# EAGLE design plug-v21-Make-board-myself-to-test-circuit (EAGLE 7.6.0)
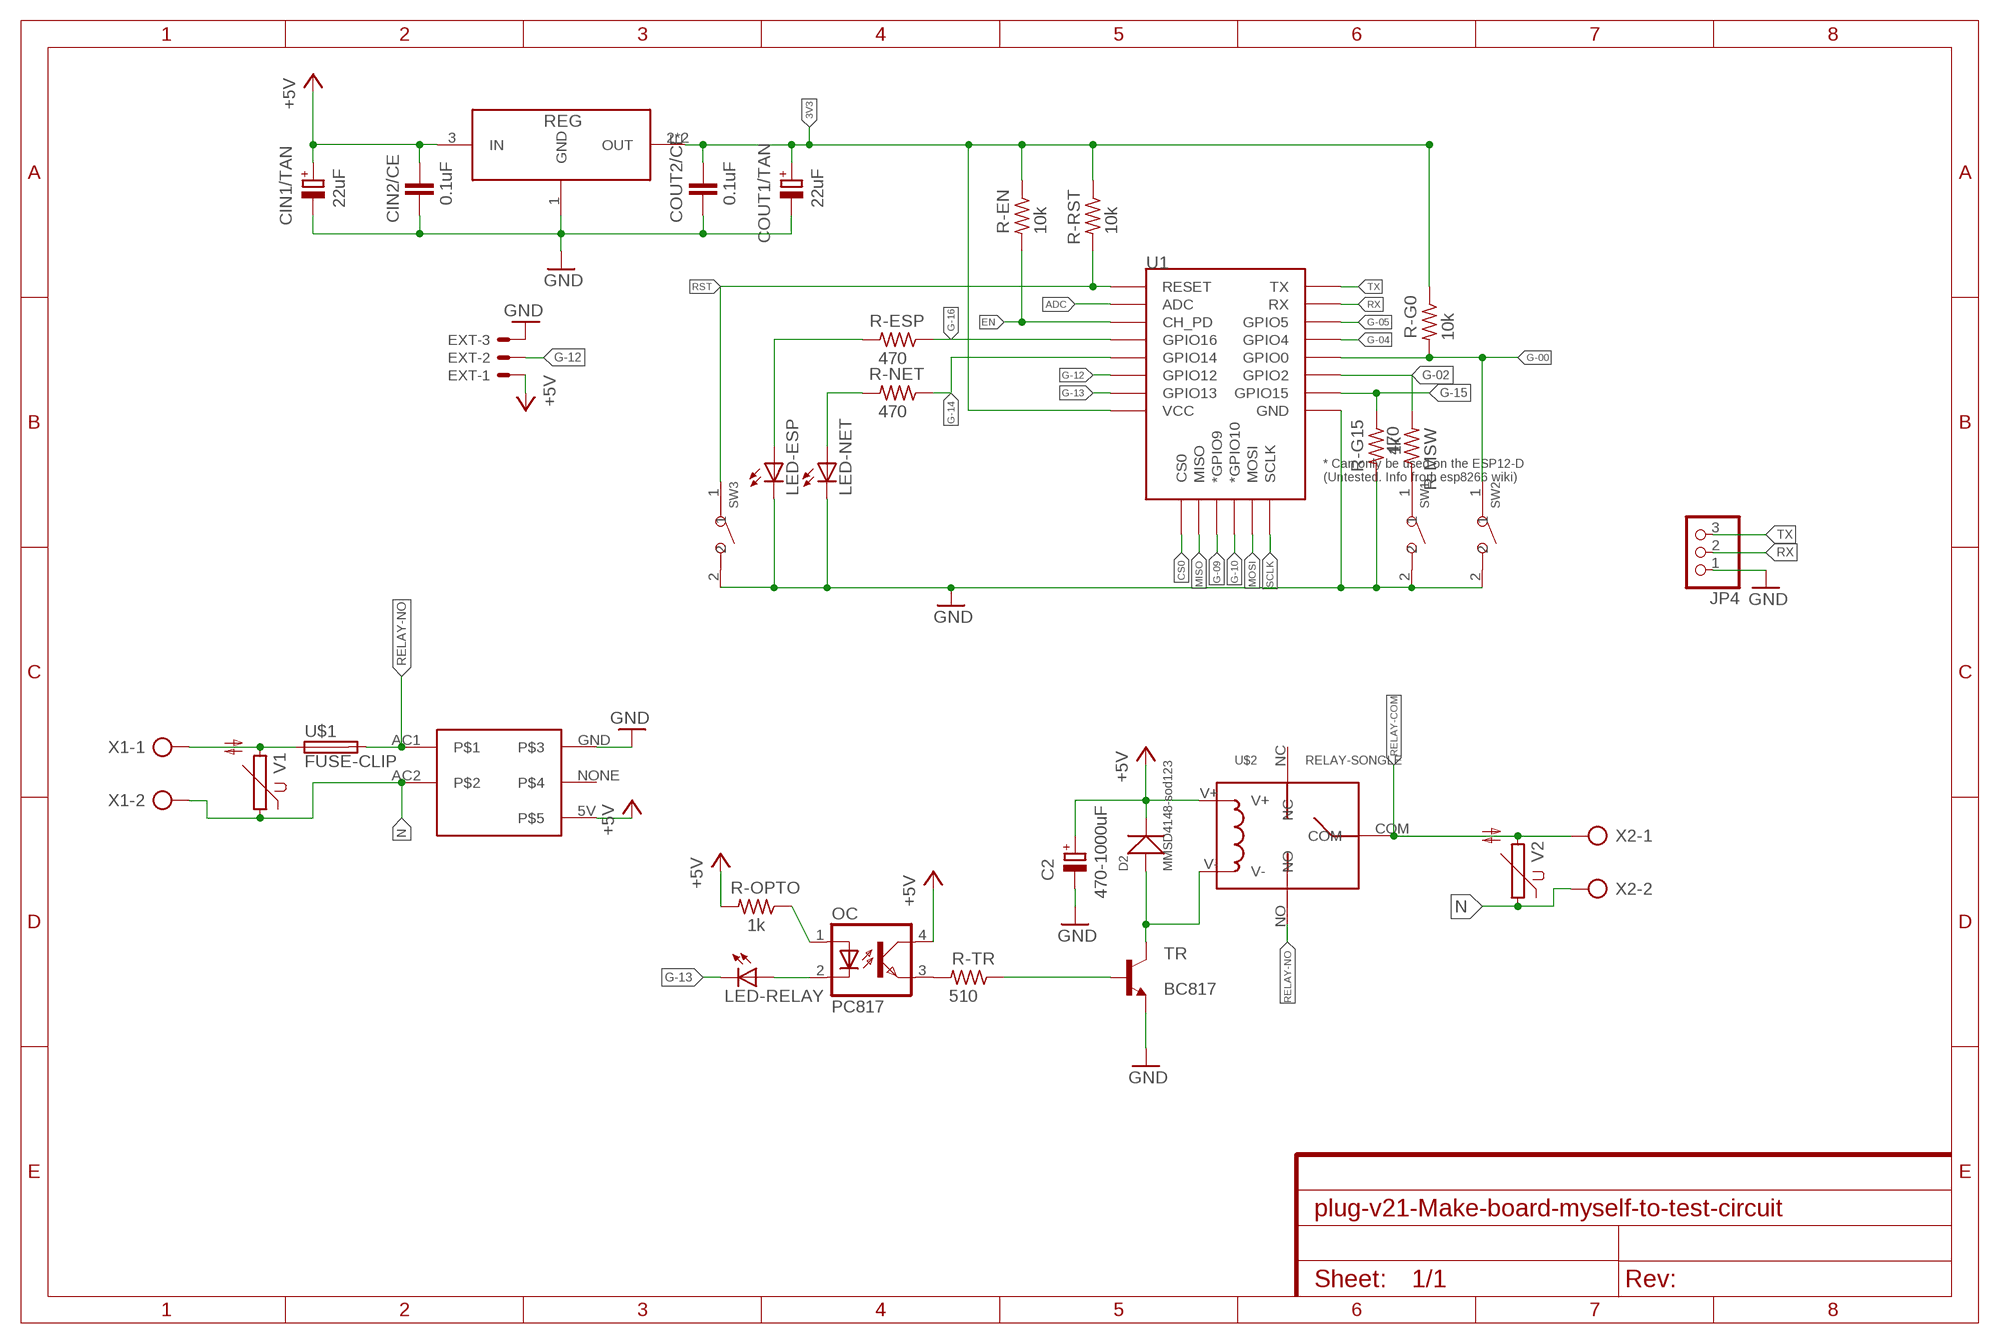
[diagram p0: schematic, sheet 1]

## Parts
C2  470-1000uF  CPOL-EUE3.5-8  [E3,5-8]
CIN1/TAN  22uF  CPOL-EUB/3528-21R  [B/3528-21R]
CIN2/CE  0.1uF  C-EUC0805K  [C0805K]
COUT1/TAN  22uF  CPOL-EUB/3528-21R  [B/3528-21R]
COUT2/CE  0.1uF  C-EUC0805K  [C0805K]
D2  MMSD4148-sod123  SMD-DIODE-100V-200MA(SOD-123)  [SOD-123]
EXT  53048-03  [53048-03]
JP4  PINHD-1X3  [1X03]
LED-ESP  LEDCHIPLED_0805  [CHIPLED_0805]
LED-NET  LEDCHIPLED_0805  [CHIPLED_0805]
LED-RELAY  LEDCHIPLED_0805  [CHIPLED_0805]
OC  PC817  [DIL04]
R-EN  10k  R-US_M0805  [M0805]
R-ESP  470  R-US_M0805  [M0805]
R-G0  10k  R-US_M0805  [M0805]
R-G15  1k  R-US_M0805  [M0805]
R-MSW  470  R-US_M0805  [M0805]
R-NET  470  R-US_M0805  [M0805]
R-OPTO  1k  R-US_M0805  [M0805]
R-RST  10k  R-US_M0805  [M0805]
R-TR  510  R-US_M0805  [M0805]
REG  AMS1117-3.3  [SOT-223]
SW1  DIP-BUTTON(2P-6.0X3.0X4.3MM)-TS-1101F  [SW2-5.0-6.0X3.0X4.3MM]
SW2  DIP-BUTTON(2P-6.0X3.0X4.3MM)-TS-1101F  [SW2-5.0-6.0X3.0X4.3MM]
SW3  DIP-BUTTON(2P-6.0X3.0X4.3MM)-TS-1101F  [SW2-5.0-6.0X3.0X4.3MM]
TR  BC817  BC817-16SMD  [SOT23-BEC]
U1  ESP12ESMD  [ESP12E-SMD]
U$1  FUSE-CLIP  [FUSE-CLIP]
U$2  RELAY-SONGLE  [RELAY-SONGLE]
U$4  POWERSUPPLY-5V-700MA  [POWERSUPPLY-5V-700MA]
V1  S14K11  [S14K11]
V2  S14K11  [S14K11]
X1  AK300/2  [AK300/2]
X2  AK300/2  [AK300/2]

## Nets
3V3: COUT1/TAN.+ COUT2/CE.1 R-EN.1 R-G0.1 R-RST.1 REG.2(OUT) REG.4(OUT) U1.VCC
+5V: C2.+ CIN1/TAN.+ CIN2/CE.1 D2.- EXT.1 OC.4(COL) R-OPTO.2 REG.3(IN) U$2.V+ U$4.5V
ADC: U1.ADC
CS0: U1.CS0
EN: R-EN.2 U1.CH_PD
G-00: R-G0.2 SW2.1 U1.GPIO0
G-02: R-MSW.2 U1.GPIO2
G-04: U1.GPIO4
G-05: U1.GPIO5
G-09: U1.GPIO9(*GPIO9)
G-10: U1.GPIO10(*GPIO10)
G-12: EXT.2 U1.GPIO12
G-13: LED-RELAY.C U1.GPIO13
G-14: R-NET.1 U1.GPIO14
G-15: R-G15.1 U1.GPIO15
G-16: R-ESP.1 U1.GPIO16
GND: C2.- CIN1/TAN.- CIN2/CE.2 COUT1/TAN.- COUT2/CE.2 EXT.3 JP4.1 LED-ESP.C LED-NET.C R-G15.2 REG.1(GND) SW1.2 SW2.2 SW3.2 TR.E U1.GND U$4.GND
LINE: U$1.3 U$1.4 V1.2 X1.1
MISO: U1.MISO
MOSI: U1.MOSI
N: U$4.AC2 V1.1 V2.1 X1.2 X2.2
N$1: OC.3(EMIT) R-TR.2
N$2: R-TR.1 TR.B
N$6: LED-ESP.A R-ESP.2
N$13: OC.1(A) R-OPTO.1
N$16: LED-NET.A R-NET.2
N$17: D2.+ TR.C U$2.V-
N$21: LED-RELAY.A OC.2(C)
N$22: R-MSW.1 SW1.1
RELAY-COM: U$2.COM V2.2 X2.1
RELAY-NO: U$1.5 U$1.6 U$2.NO U$4.AC1
RST: R-RST.2 SW3.1 U1.RESET
RX: JP4.2 U1.RXD0(RX)
SCLK: U1.SCLK
TX: JP4.3 U1.TXD0(TX)
Unconnected: U$2.NC U$4.NONE

## Library data of the parts
C2 CIN1/TAN COUT1/TAN = rcl:CPOL-EU: POLARIZED CAPACITOR, European symbol
CIN2/CE COUT2/CE = rcl:C-EU: CAPACITOR, European symbol
D2 = Seeed-OPL-Diode:SMD-DIODE-100V-200MA(SOD-123): 304010007; MPN: MMSD4148
EXT = con-molex:53?-03: CONNECTOR wire to board 1.25 mm (.049 inch) pitch header; MF: WALDOM/MOLEX; MPN: 53048-0310; OC_FARNELL: 9732918; OC_NEWARK: 38C9908
JP4 = pinhead:PINHD-1X3: PIN HEADER
LED-ESP LED-NET LED-RELAY = led:LED: LED OSRAM: - CHIPLED LG R971, LG N971, LY N971, LG Q971, LY Q971, LO R971, LY R971 LH N974, LH R974 LS Q976, LO Q976, LY Q976 LO Q996 - Hyper CHIPLED LW Q18S LB Q993, LB Q99A, LB R99A - SideLED LS A670, LO A670, LY A670, LG A670, LP A670 LB A673, LV A673, LT A673, LW A673 LH A674 LY A675 LS A676, LA A676, LO A676, LY A676, LW A676 LS A679, LY A679, LG A679 - Hyper Micro SIDELED® LS Y876, LA Y876, LO Y876, LY Y876 LT Y87S - SmartLED LW L88C, LW L88S LB L89C, LB L89S, LG L890 LS L89K, LO L89K, LY L89K LS L896, LA L896, LO L896, LY L896 - TOPLED LS T670, LO T670, LY T670, LG T670, LP T670 LSG T670, LSP T670, LSY T670, LOP T670, LYG T670 LG T671, LOG T671, LSG T671 LB T673, LV T673, LT T673, LW T673 LH T674 LS T676, LA T676, LO T676, LY T676, LB T676, LH T676, LSB T676, LW T676 LB T67C, LV T67C, LT T67C, LS T67K, LO T67K, LY T67K, LW E67C LS E67B, LA E67B, LO E67B, LY E67B, LB E67C, LV E67C, LT E67C LW T67C LS T679, LY T679, LG T679 LS T770, LO T770, LY T770, LG T770, LP T770 LB T773, LV T773, LT T773, LW T773 LH T774 LS E675, LA E675, LY E675, LS T675 LS T776, LA T776, LO T776, LY T776, LB T776 LHGB T686 LT T68C, LB T68C - Hyper Mini TOPLED® LB M676 - Mini TOPLED Santana® LG M470 LS M47K, LO M47K, LY M47K Source: http://www.osram.convergy.de LUXEON: - LUMILED® LXK2-PW12-R00, LXK2-PW12-S00, LXK2-PW14-U00, LXK2-PW14-V00 LXK2-PM12-R00, LXK2-PM12-S00, LXK2-PM14-U00 LXK2-PE12-Q00, LXK2-PE12-R00, LXK2-PE12-S00, LXK2-PE14-T00, LXK2-PE14-U00 LXK2-PB12-K00, LXK2-PB12-L00, LXK2-PB12-M00, LXK2-PB14-N00, LXK2-PB14-P00, LXK2-PB14-Q00 LXK2-PR12-L00, LXK2-PR12-M00, LXK2-PR14-Q00, LXK2-PR14-R00 LXK2-PD12-Q00, LXK2-PD12-R00, LXK2-PD12-S00 LXK2-PH12-R00, LXK2-PH12-S00 LXK2-PL12-P00, LXK2-PL12-Q00, LXK2-PL12-R00 Source: www.luxeon.com KINGBRIGHT: KA-3528ASYC Source: www.kingbright.com
OC = optocoupler:PC817: SHARP OPTO COUPLER; MPN: PC817X4J000F; OC_FARNELL: 9707727; OC_NEWARK: 97K7059
R-EN R-ESP R-G0 R-G15 R-MSW R-NET R-OPTO R-RST R-TR = rcl:R-US_: RESISTOR, American symbol
REG = AMS1117-3.3:AMS1117-3.3: 1A LOW DROPOUT VOLTAGE REGULATOR
SW1-SW3 = Seeed-OPL-Switch:DIP-BUTTON(2P-6.0X3.0X4.3MM): 311020025
TR = transistor-npn:BC817*: NPN Transistor
U1 = esp8266modules:ESP12E: ESP12E Module
U$1 = Fuse-Clip:FUSE-CLIP
U$2 = Relay-Songle:RELAY-SONGLE
U$4 = PowerSupply-5V-700mA:POWERSUPPLY-5V-700MA
V1 V2 = varistor:S14K11: VARISTOR
X1 X2 = con-ptr500:AK300/2: CONNECTOR; OC_FARNELL: unknown; OC_NEWARK: unknown

## Board
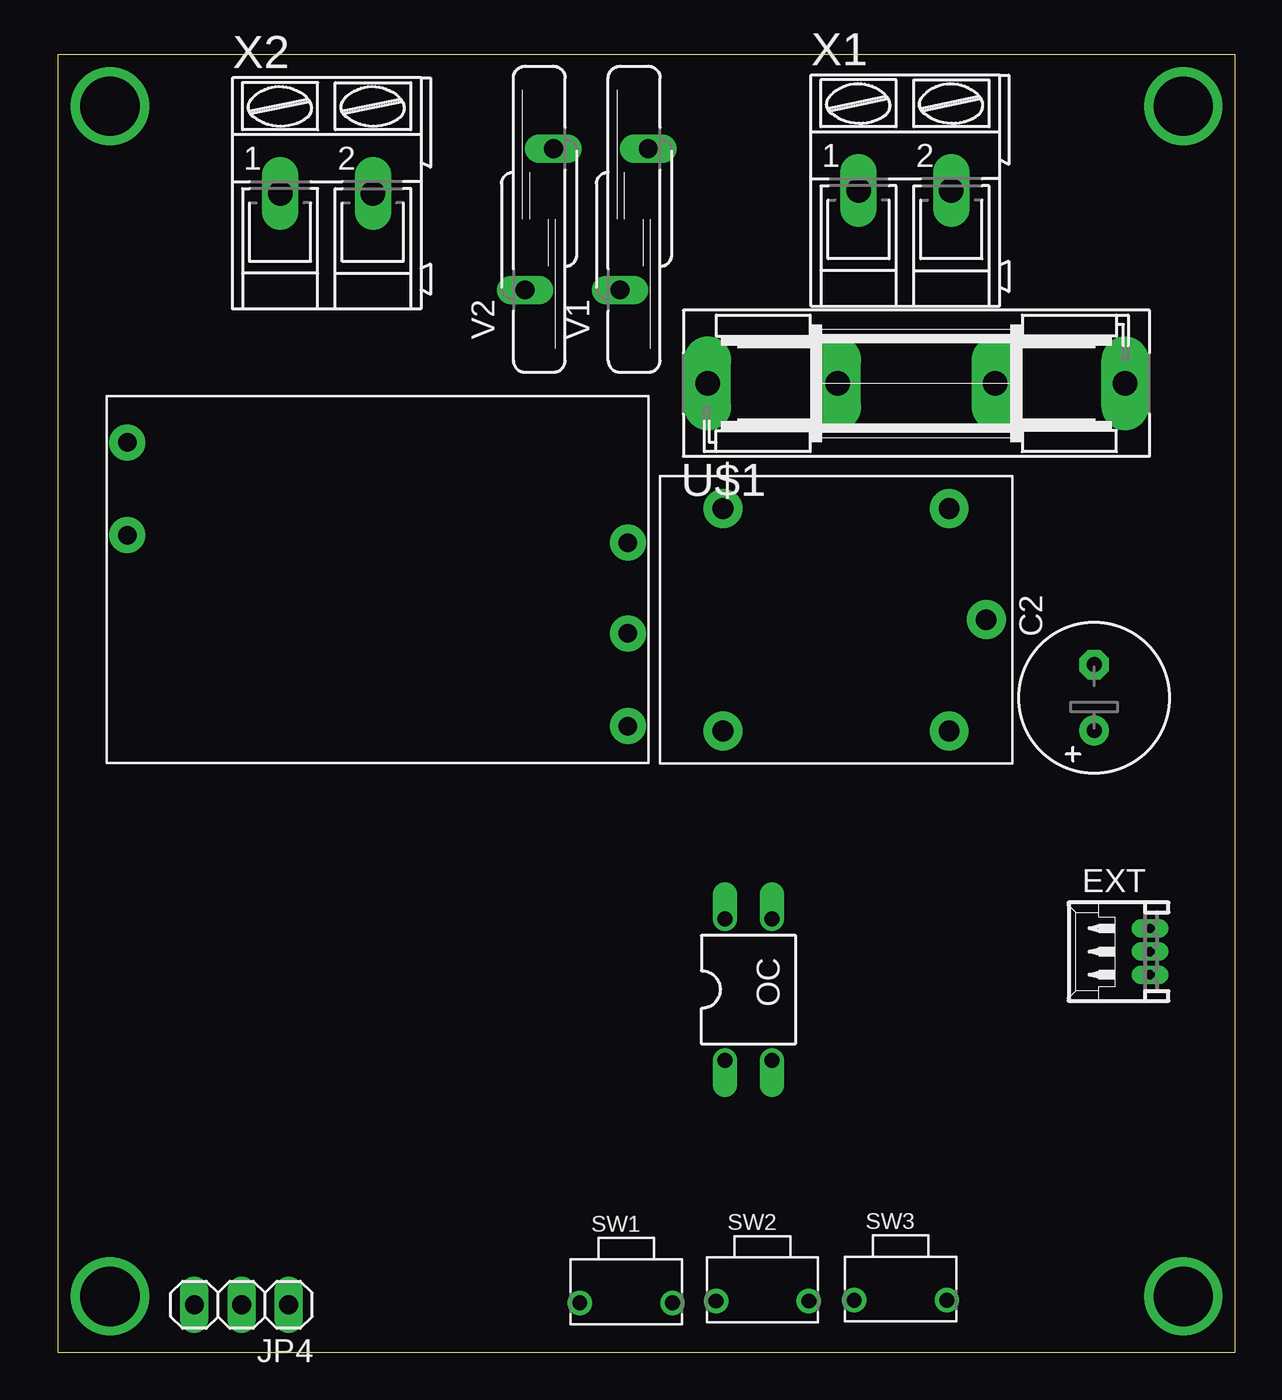
[diagram p1: board, top side]
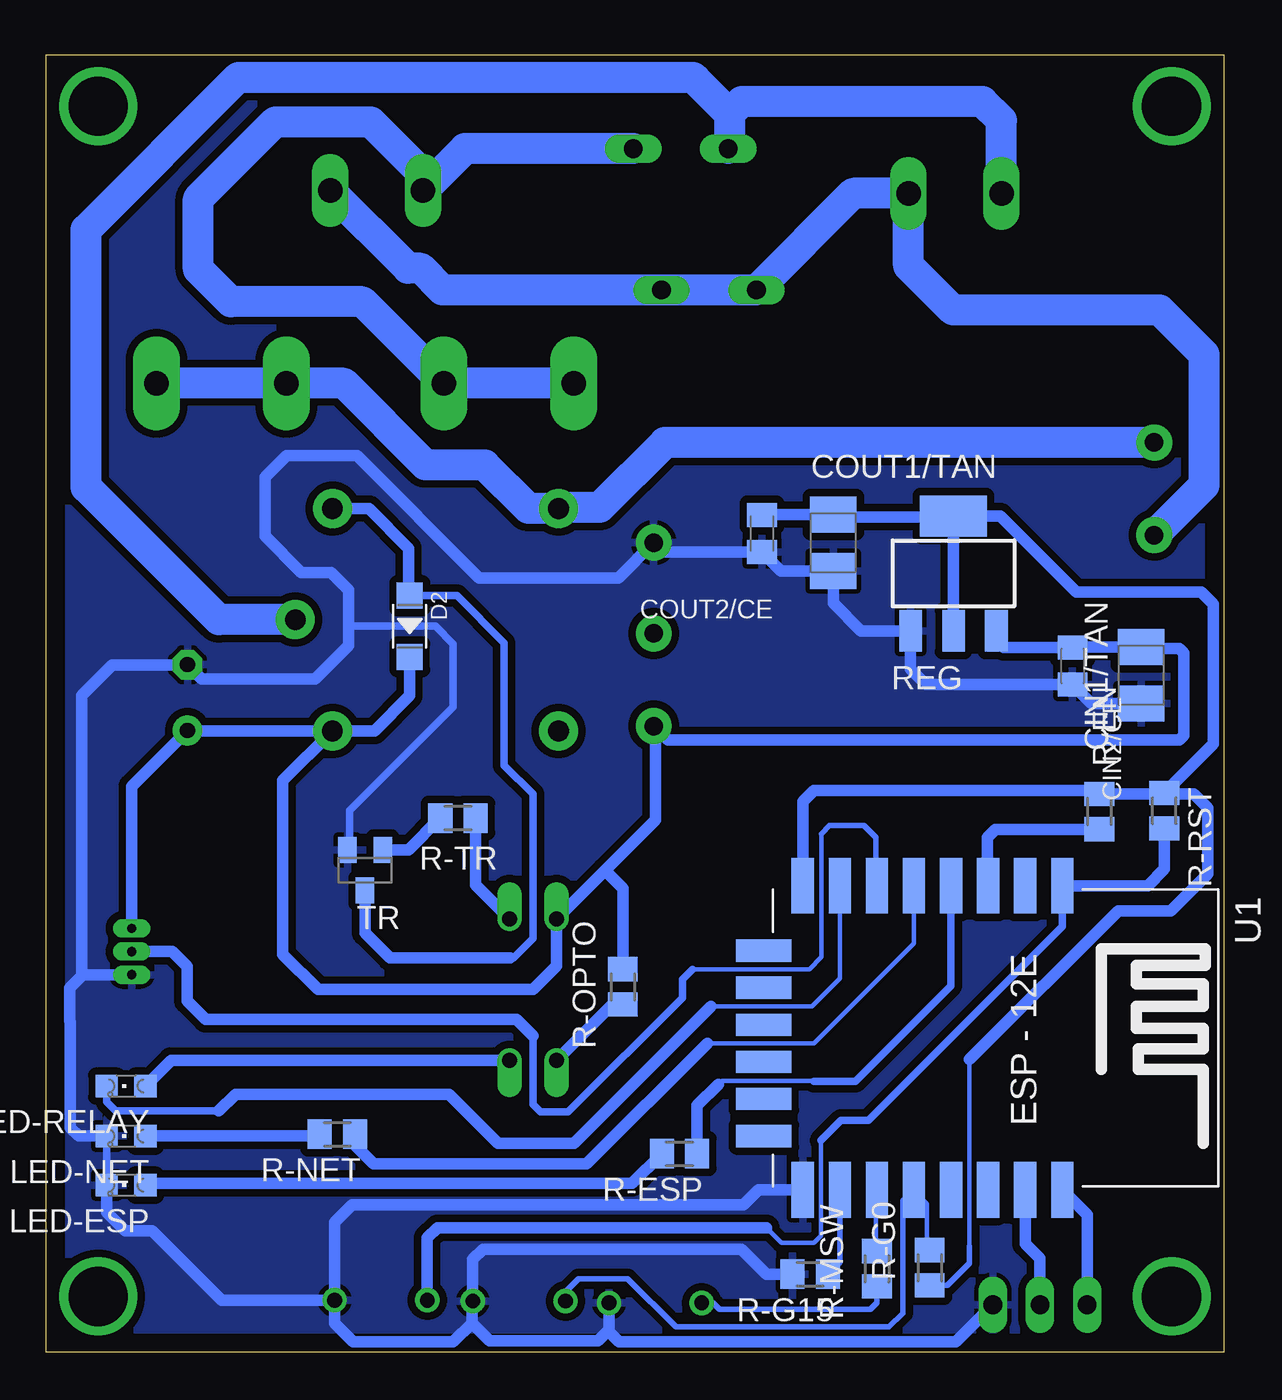
[diagram p2: board, bottom side, seen from below]

Size 63.5 x 69.98 mm. Coordinates in mm from the lower left corner, seen from the top.
Outline: 0,0 63.5,0 63.5,69.98 0,69.98 0,0
Copper layers (1*16): Top 0.035mm / dielectric 1.5mm / Bottom 0.035mm
Design rules "default": minimum track width 10mil, minimum drill 24mil, track to track 8mil, track to pad 8mil, pad to pad 8mil, via to via 8mil, smd to smd 8mil, copper to edge 40mil, drill to drill 8mil, minimum pad ring 10mil, minimum via ring 8mil, stop-mask expansion 4mil, vias tented up to drill 0mil, thermal gap 10mil

### Footprints (pad centres in the part's own frame; a part is rotated, then mirrored left to right if it is on the bottom)
E3,5-8 = drill 0.813 pad 1.6: + -1.778,0 | drill 0.813 pad 1.6 octagon: - 1.778,0
B/3528-21R = smd 1.95 x 2.5: + 1.525,0; - -1.525,0
C0805K = smd 1.3 x 1.6: 1 -1,0; 2 1,0
SOD-123 = smd 1.397 x 1.397: + -1.651,0; - 1.651,0
53048-03 = drill 0.5 pad 0.698 long: 1 1.25,-1.25; 2 0,-1.25; 3 -1.25,-1.25
1X03 = drill 1.016 long: 1 -2.54,0; 2 0,0; 3 2.54,0
CHIPLED_0805 = smd 1.2 x 1.2: A 0,-1.05; C 0,1.05
DIL04 = drill 0.813 offset: 1 -1.27,-3.81; 2 1.27,-3.81; 3 1.27,3.81; 4 -1.27,3.81
M0805 = smd 1.3 x 1.6: 1 -0.95,0; 2 0.95,0
SOT-223 = smd 1.219 x 2.235: 1 -2.381,-3.099; 2 -0.07,-3.099; 3 2.241,-3.099 | smd 3.6 x 2.2: 4 -0.07,3.099
SW2-5.0-6.0X3.0X4.3MM = drill 0.8 pad 1.27: 1 -2.5,0; 2 2.5,0
SOT23-BEC = smd 1 x 1.4: B -0.95,-1.1; C 0,1.1; E 0.95,-1.1
ESP12E-SMD = smd 3 x 1.2: ADC -8.3,3.8; CH_PD -8.3,1.8; GND 8.1,-8.2; GPIO0 8.1,-2.2; GPIO2 8.1,-4.2; GPIO4 8.1,-0.2; GPIO5 8.1,1.8; GPIO12 -8.3,-4.2; GPIO13 -8.3,-6.2; GPIO14 -8.3,-2.2; GPIO15 8.1,-6.2; GPIO16 -8.3,-0.2; RESET -8.3,5.8; RXD0 8.1,3.8; TXD0 8.1,5.8; VCC -8.3,-8.2 | smd 1.2 x 3: CS0 -4.8,-10.3; GPIO9 -0.8,-10.3; GPIO10 1.2,-10.3; MISO -2.8,-10.3; MOSI 3.2,-10.3; SCLK 5.2,-10.3
FUSE-CLIP = drill 1.321 pad 2.54 long: 1 -11.252,0; 2 11.252,0; 3 -11.252,0; 4 -4.252,0; 5 11.252,0; 6 4.252,0
RELAY-SONGLE = drill 1.118 pad 2.1: COM -8.1,0; NC 6.1,6; NO 6.1,-6; V+ -6.1,6; V- -6.1,-6
POWERSUPPLY-5V-700MA = drill 1 pad 1.93: 5V 13.5,-7.9; AC1 -13.5,7.4; AC2 -13.5,2.4; GND 13.5,2; NONE 13.5,-2.9
S14K11 = drill 1.016 long: 1 -0.762,-3.81; 2 0.762,3.81
AK300/2 = drill 1.321 long: 1 -2.515,0; 2 2.489,0

### Placement (x,y rotation side)
C2  55.89,35.3 90 top
CIN1/TAN  4.45,36.5 90 bottom
CIN2/CE  8.15,37 270 bottom
COUT1/TAN  21.05,43.65 90 bottom
COUT2/CE  24.9,44.15 270 bottom
D2  43.9,39.15 270 bottom
EXT  57.65,21.6 90 top
JP4  9.9,2.55 180 top
LED-ESP  59.2,9 90 bottom
LED-NET  59.2,11.65 90 bottom
LED-RELAY  59.2,14.35 90 bottom
OC  37.25,19.55 0 top
R-EN  6.7,29.15 270 bottom
R-ESP  29.35,10.7 180 bottom
R-G0  15.85,4.55 90 bottom
R-G15  22.3,4.2 180 bottom
R-MSW  18.7,4.5 90 bottom
R-NET  47.8,11.75 180 bottom
R-OPTO  32.4,19.7 90 bottom
R-RST  3.2,29.2 270 bottom
R-TR  41.3,28.8 0 bottom
REG  14.5,42 0 bottom
SW1  30.65,2.65 0 top
SW2  38,2.75 0 top
SW3  45.45,2.8 0 top
TR  46.31,25.99 180 bottom
U1  14.5,16.85 270 bottom
U$1  46.3,52.25 0 top
U$2  41.97,39.5 180 top
U$4  17.24,41.66 0 top
V1  31.08,61.1 0 top
V2  25.96,61.1 0 top
X1  45.7,62.65 0 top
X2  14.5,62.5 0 top

### Tracks (layer width: path | path; a pad name or v marks a point on that pad's centre or on a via)
3V3
  Bottom 0.254: 14.63,39.09 REG.2 | 14.63,45.03 REG.4 | 13.72,15.77 13.72,5.71 | R-RST.1 3.2,30.18 3.2,30.1
  Bottom 0.305: 13.72,5.71 13.72,4.78 14.9,3.6 R-G0.1
  Bottom 0.406: 3.25,30.1 3.2,30.1
  Bottom 0.61: COUT2/CE.1 24.88,45.17 COUT1/TAN.+ 20.91,45.03 14.63,45.03 14.57,44.97 REG.2 | U1.VCC 22.7,29.7 22.1,30.3 6.9,30.3 R-EN.1 3.25,30.1 | REG.4 12.05,45.1 7.95,41 1.2,41 0.55,40.35 0.55,32.8 R-RST.1 | 3.2,30.1 1.6,30.1 0.85,29.35 0.85,25.8 2.85,23.8 5.69,23.8 13.72,15.77
+5V
  Bottom 0.254: 4.34,37.95 CIN1/TAN.+ | 30.63,33.6 U$4.5V
  Bottom 0.305: 50.5,33.4 50.6,33.5
  Bottom 0.61: U$2.V+ 50.6,33.5 55.87,33.5 C2.+ 58.9,30.51 EXT.1 | 30.63,33.6 30.63,28.71 33.37,25.97 | 33.37,25.97 OC.4 35.98,20.82 37.25,19.55 48.85,19.55 50.75,21.45 50.75,30.82 U$2.V+ | R-OPTO.2 32.4,25 33.37,25.97 | REG.3 12.25,38.4 11.85,38 CIN2/CE.1 8.12,38.02 CIN1/TAN.+ | D2.- 43.9,35.4 45.8,33.5 U$2.V+ | 4.34,37.95 2.4,37.95 2.15,37.7 2.15,33.25 2.4,33 29.98,33 U$4.5V
EN
  Bottom 0.61: R-EN.2 12.3,28.2 12.75,27.75 12.75,25.2 U1.CH_PD
G-00
  Bottom 0.254: R-G0.2 16,5.71 16,8 16.69,8.69 U1.GPIO0
  Bottom 0.305: U1.GPIO0 17.3,8.15 17.3,2.1 18.05,1.35 29.55,1.35 32.15,3.95 34.8,3.95 35.5,3.25 SW2.1
G-02
  Bottom 0.254: R-MSW.2 18.75,5.49 18.75,8.69 U1.GPIO2
G-12
  Bottom 0.254: 18.75,27.7 18.75,27.75 | 21.7,27.95 21.7,21.3 22.35,20.65 28.65,20.65 | 18.75,25.2 U1.GPIO12
  Bottom 0.305: 18.75,27.75 19.4,28.4 21.25,28.4 21.7,27.95 | 18.75,27.7 18.75,25.2
  Bottom 0.406: 28.65,20.65 29.2,20.1 29.2,19.1 35.35,12.95 36.85,12.95 37.25,13.35 37.25,17.05
  Bottom 0.61: 37.25,17.05 38.15,17.95 54.9,17.95 55.9,18.95 55.9,20.8 56.7,21.6 EXT.2
G-13
  Bottom 0.254: U1.GPIO13 20.7,20.15 22.2,18.65 27.65,18.65
  Bottom 0.406: 54.2,13 59.75,13 60.25,13.5 LED-RELAY.C
  Bottom 0.61: 27.65,18.65 35.05,11.25 39.14,11.25 41.79,13.9 53.3,13.9 54.2,13
G-14
  Bottom 0.254: U1.GPIO14 16.7,22.05 22.1,16.65 27.85,16.65
  Bottom 0.406: 46.85,11.15 R-NET.1
  Bottom 0.61: 27.85,16.65 34.35,10.15 45.85,10.15 46.85,11.15
G-15
  Bottom 0.305: U1.GPIO15 20.7,4.85 R-G15.1
G-16
  Bottom 0.254: 22.1,14.6 22.13,14.63 27.07,14.63 27.25,14.45
  Bottom 0.406: U1.GPIO16 14.7,19.75 19.85,14.6 22.1,14.6
  Bottom 0.61: 27.25,14.45 28.4,13.3 R-ESP.1
GND
  Bottom 0.254: 40.46,2.74 SW2.2
  Bottom 0.305: 40.6,2.65 SW2.2 | TR.E 47.15,27.2
  Bottom 0.406: LED-ESP.C LED-NET.C | 47.15,27.2 47.15,29.2 41.55,34.8 41.55,38.2 42.5,39.15 47.2,39.15
  Bottom 0.61: LED-NET.C 61.75,11.65 62.2,12.1 62.2,17.8 62.25,17.85 62.25,19.65 61.55,20.35 | LED-ESP.C 60.25,7.55 59.25,6.55 57.8,6.55 54.05,2.8 SW3.2 | CIN1/TAN.- 7.12,34.98 CIN2/CE.2 16.05,36 16.9,36.85 16.9,38.88 REG.1 19.55,38.9 21.05,40.4 COUT1/TAN.- 23.88,42.12 COUT2/CE.2 30.23,43.15 U$4.GND 32.65,41.75 40.15,41.75 46.75,48.35 50.55,48.35 51.7,47.2 51.7,44 49.75,42.05 48.15,42.05 47.2,41.1 47.2,39.15 47.2,38.1 49,36.3 55.11,36.3 C2.- 55.92,37.05 59.95,37.05 61.6,35.4 61.6,20.4 61.55,20.35 | SW3.2 47.95,7 47,7.95 25.9,7.95 25.1,8.75 U1.GND | R-G15.2 24.65,4.2 26,5.55 39.95,5.55 40.5,5 SW2.2 40.55,2.7 40.55,1.55 | SW3.2 47.95,1.55 46.95,0.55 41.55,0.55 40.55,1.55 | SW1.2 33.15,1.2 33.23,1.12 | 33.23,1.12 33.75,0.6 39.6,0.6 40.55,1.55 | JP4.1 14.44,0.55 32.6,0.55 33.17,1.12 33.23,1.12 | EXT.3 61.55,20.35
  pour Bottom (isolate 0.406): 0,0 63.75,0 63.75,70.1 0,70.1
LINE
  Bottom 1.676: U$1.3 U$1.4 46.45,56.65 53.55,56.65 55.3,58.4 55.3,62.2 51.15,66.35 46,66.35 43.19,63.53 X1.1 40.92,64.91 V1.2
N
  Bottom 1.676: U$4.AC2 1.05,46.75 1.05,53.8 3.45,56.2 14.6,56.2 16.99,58.59 X2.2 19.99,62.5 V2.1 V1.1 42.14,57.29 43.3,58.45 43.99,58.45 X1.2
N$1
  Bottom 0.61: OC.3 40.35,25.19 R-TR.2
N$2
  Bottom 0.61: R-TR.1 43.96,27.09 TR.B
N$3  (via drill 3.2)
  other vias: 2.8,67.2
N$4  (via drill 3.2)
  other vias: 2.8,3
N$5  (via drill 3.2)
  other vias: 60.7,3
N$6
  Bottom 0.406: 58.05,9.1 LED-ESP.A
  Bottom 0.61: R-ESP.2 31.9,9.1 58.05,9.1
N$7  (via drill 3.2)
  other vias: 60.7,67.2
N$13
  Bottom 0.61: R-OPTO.1 32.97,18.75 OC.1
N$16
  Bottom 0.61: R-NET.2 48.85,11.65 LED-NET.A
N$17
  Bottom 0.406: D2.+ 41.35,40.8 38.8,38.25 38.8,31.65 37.25,30.1 37.25,22.3 38.3,21.25 38.5,21.25
  Bottom 0.61: U$2.V- 46.1,45.5 43.95,43.35 43.95,40.85 D2.+ | TR.C 46.31,22.61 44.95,21.25 38.5,21.25
N$21
  Bottom 0.61: OC.2 56.76,15.74 LED-RELAY.A
N$22
  Bottom 0.305: R-MSW.1 18.7,2.65 19.05,2.3 27.2,2.3 27.55,2.65 SW1.1
RELAY-COM
  Bottom 1.676: X2.1 11.98,66.44 13,67.45 26,67.45 26.65,66.8 | 26.65,66.8 26.65,64.98 V2.2 | 26.65,66.8 28.3,68.45 28.6,68.75 53.15,68.75 61.35,60.55 61.35,46.65 54.2,39.5 U$2.COM
RELAY-NO
  Bottom 1.676: U$4.AC1 30.14,49.06 33.65,45.55 35.82,45.55 U$2.NO 37.5,45.5 39.85,47.85 43.05,47.85 47.45,52.25 U$1.6 U$1.5
RST
  Bottom 0.254: 21.72,11.43 21.72,6.28 22.1,5.9 23.85,5.9 24.48,6.53 24.47,6.55
  Bottom 0.305: 24.48,6.53 24.65,6.7
  Bottom 0.406: U1.RESET 8.7,22.95 19.15,12.5 20.65,12.5 21.72,11.43
  Bottom 0.61: R-RST.2 3.2,26.05 4.1,25.15 U1.RESET | SW3.1 42.95,6.15 42.4,6.7 24.65,6.7
RX
  Bottom 0.61: U1.RXD0 10.7,5.85 9.9,5.05 JP4.2
TX
  Bottom 0.61: U1.TXD0 7.36,7.41 JP4.3